# EAGLE schematic Wheel Speed Sensor smd (EAGLE 9.5.0)
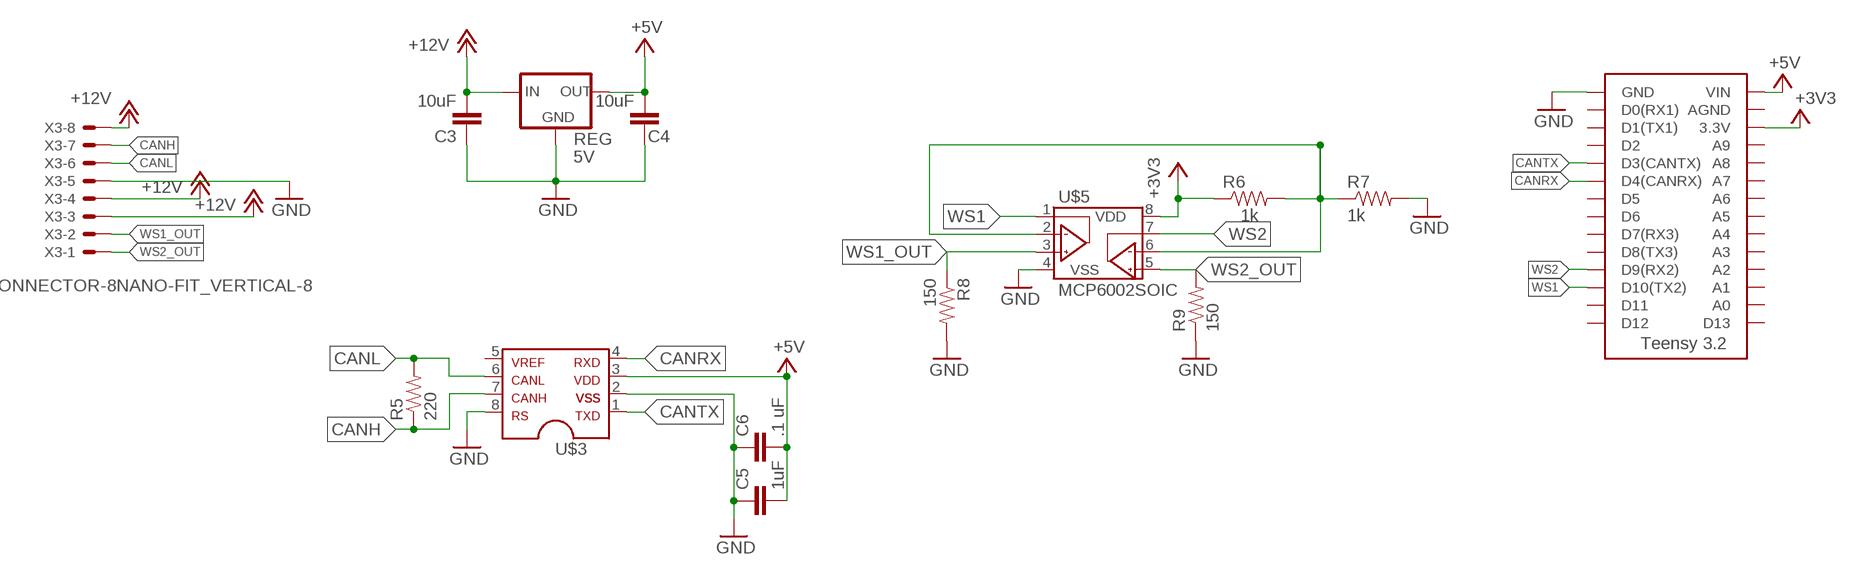
[diagram p0: schematic, sheet 1]

## Parts
C3  10uF  CAP0603-CAP  [0603-CAP]
C4  10uF  CAP0603-CAP  [0603-CAP]
C5  1uF  CAP0603-CAP  [0603-CAP]
C6  .1 uF  CAP0603-CAP  [0603-CAP]
R5  220  RESISTOR0603  [0603-RES]
R6  1k  RESISTOR0603-RES  [0603-RES]
R7  1k  RESISTOR0603-RES  [0603-RES]
R8  150  RESISTOR0603-RES  [0603-RES]
R9  150  RESISTOR0603-RES  [0603-RES]
REG  5V  OKI-78SR-5  [OKI-78SR]
U$2  TEENSY_3.2_SIMPLE  [TEENSY_3.2_SIMPLE]
U$3  MCP2551  [SOIC-08]
U$5  MCP6002SOIC  [SOIC-08]
X3  CONNECTOR-8NANO-FIT_VERTICAL-8  [NANO-FIT_VERTICAL-8]

## Nets
+3V3: R6.1 U$2.3.3V U$5.8(VDD)
+5V: C4.2 C5.2 C6.2 REG.3(OUT) U$2.VIN U$3.3
+12V: C3.2 REG.1(IN) X3.P$3 X3.P$4 X3.P$8
CANH: R5.1 U$3.7 X3.P$7
CANL: R5.2 U$3.6 X3.P$6
CANRX: U$2.D4(CANRX) U$3.4
CANTX: U$2.D3(CANTX) U$3.1
GND: C3.1 C4.1 C5.1 C6.1 R7.2 R8.2 R9.1 REG.2(GND) U$2.GND U$3.2 U$3.8 U$5.4(VSS) X3.P$5
N$10: R6.2 R7.1 U$5.2(VINA-) U$5.6(VINB-)
WS1: U$2.D10(TX2) U$5.1(VOUTA)
WS1_OUT: R8.1 U$5.3(VINA+) X3.P$2
WS2: U$2.D9(RX2) U$5.7(VOUTB)
WS2_OUT: R9.2 U$5.5(VINB+) X3.P$1
Unconnected: U$2.A0 U$2.A1 U$2.A2 U$2.A3 U$2.A4 U$2.A5 U$2.A6 U$2.A7 U$2.A8 U$2.A9 U$2.AGND U$2.D0(RX1) U$2.D1(TX1) U$2.D2 U$2.D5 U$2.D6 U$2.D7(RX3) U$2.D8(TX3) U$2.D11 U$2.D12 U$2.D13 U$3.5

## Library data of the parts
C3-C6 = HyTechDevices:CAP: Capacitor Standard 0603 ceramic capacitor, and 0.1" leaded capacitor.
R5-R9 = HyTechDevices:RESISTOR: Resistor Basic schematic elements and footprints for 0603, 1206, and PTH resistors.
REG = HyTechDevices:OKI-78SR-5: Murata OKI-78SR 5V 1.5A Non-Isolated Switching Regulator DC/DC - Datasheet <https://power.murata.com/data/power/oki-78sr.pdf>
U$2 = HyTechDevices:TEENSY_3.2_SIMPLE: Simple version of the Teensy 3.2 board that only uses the 2 main rows of pins, not the inner pins or the pins opposite the usb port.
U$3 = HyTechDevices:MCP2551: MCP2551 High-Speed CAN Transceiver Product Webpage <https://www.microchip.com/wwwproducts/en/MCP2551> Datasheet <http://ww1.microchip.com/downloads/en/DeviceDoc/21667f.pdf> This device is outdated It is replaced by MCP2561. Comparison Page <https://www.microchip.com/wwwproducts/ProductCompare/MCP2551/MCP2561> Product Webpage <https://www.microchip.com/wwwproducts/en/MCP2561> Datasheet <http://ww1.microchip.com/downloads/en/DeviceDoc/20005167C.pdf>
U$5 = HyTechDevices:MCP6002: Microchip MCP6002 Dual Channel Op Amp
X3 = HyTechDevices:CONNECTOR-8: Mini-Fit Junior connector 8 pole Source: http://www.molex.com